# EAGLE design pwmsmu (EAGLE 5.11)
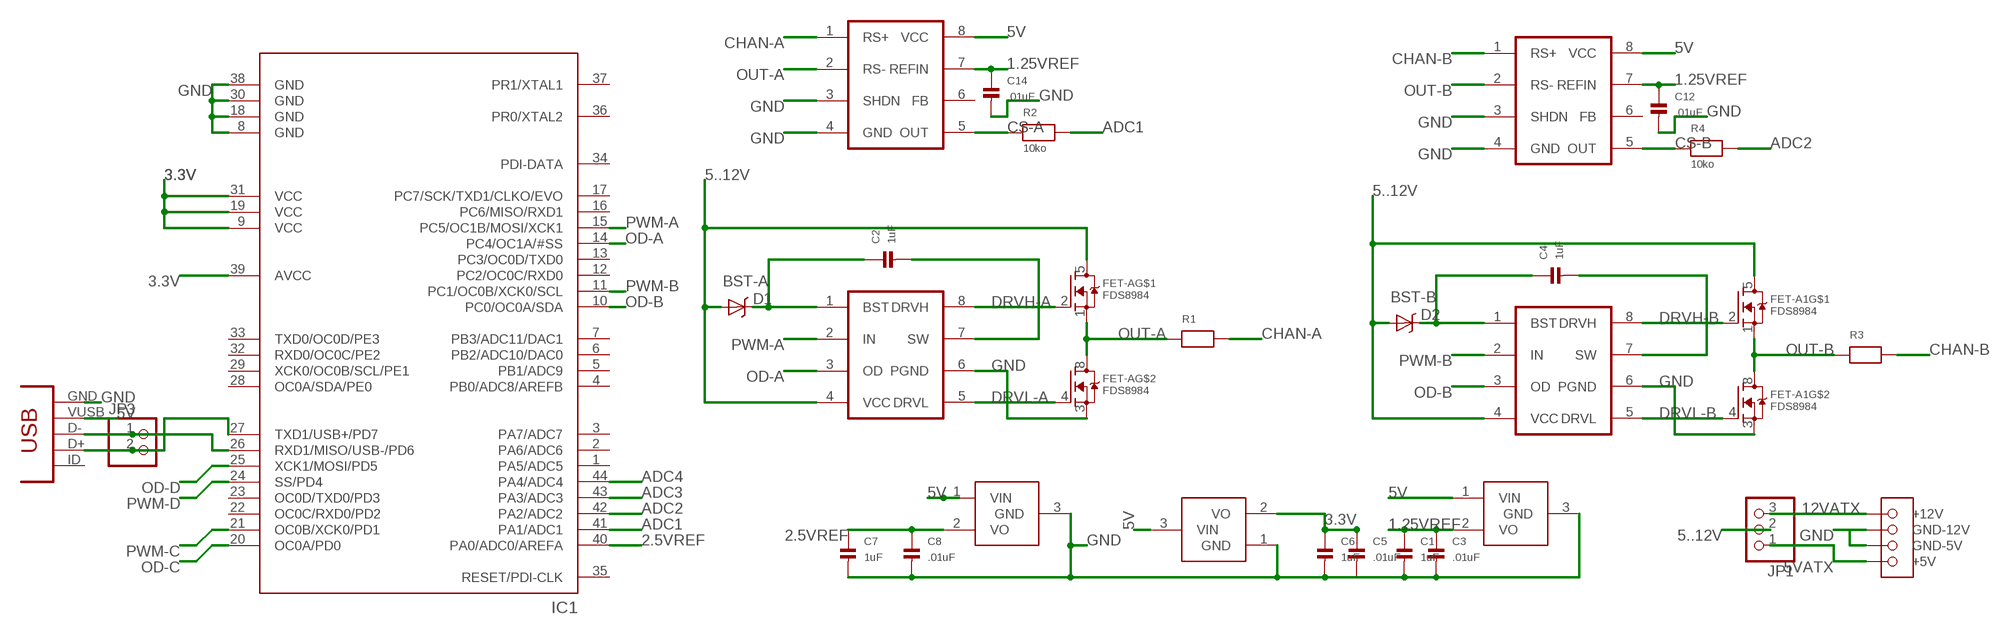
[diagram p0: schematic, sheet 1, part 1 of 2]
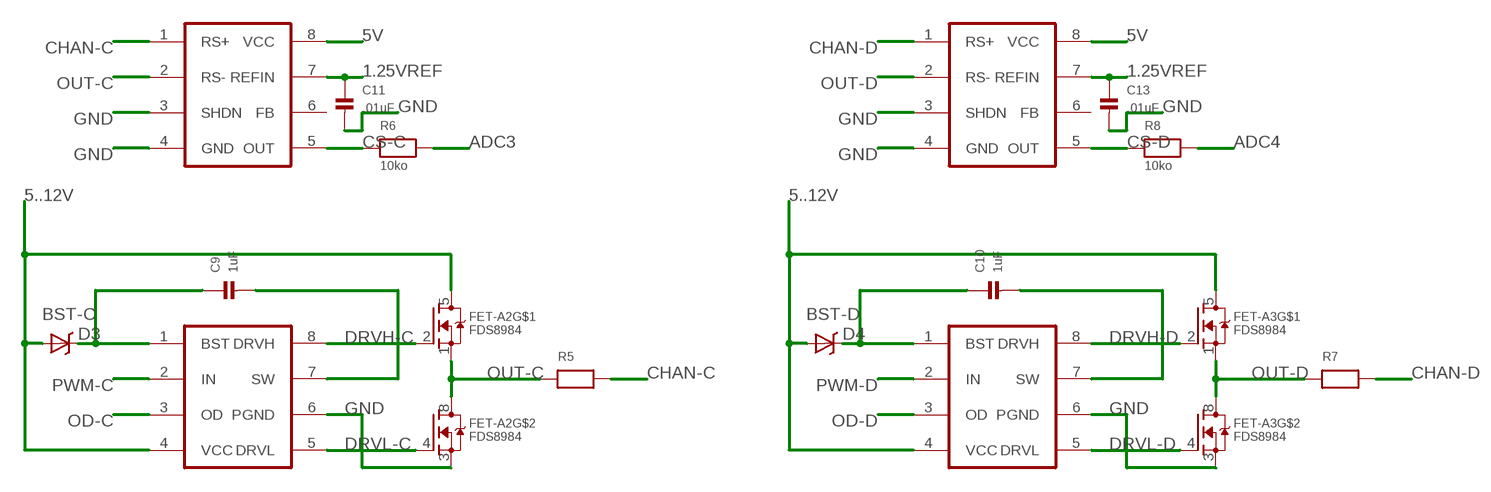
[diagram p1: schematic, sheet 1, part 2 of 2]

## Parts
1.25V  VREF  [SOT23-3]
2.5V  VREF  [SOT23-3]
3.3V  VREG  [SOT23-3]
ATXPSU  0015244742  [DISK_DRIVE_POWER]
C1  1uF  CAP_CERAMIC0603  [0603]
C2  1uF  CAP_CERAMIC0603  [0603]
C3  .01uF  CAP_CERAMIC0603  [0603]
C4  1uF  CAP_CERAMIC0603  [0603]
C5  .01uF  CAP_CERAMIC0603  [0603]
C6  1uF  CAP_CERAMIC0603  [0603]
C7  1uF  CAP_CERAMIC0603  [0603]
C8  .01uF  CAP_CERAMIC0603  [0603]
C9  1uF  CAP_CERAMIC0603  [0603]
C10  1uF  CAP_CERAMIC0603  [0603]
C11  .01uF  CAP_CERAMIC0603  [0603]
C12  .01uF  CAP_CERAMIC0603  [0603]
C13  .01uF  CAP_CERAMIC0603  [0603]
C14  .01uF  CAP_CERAMIC0603  [0603]
D1  SCHOTTKY  [SMA-DIODE]
D2  SCHOTTKY  [SMA-DIODE]
D3  SCHOTTKY  [SMA-DIODE]
D4  SCHOTTKY  [SMA-DIODE]
FET-A  FDS8984  FDS898SO-08  [SO-08@1]
FET-A1  FDS8984  FDS898SO-08  [SO-08@1]
FET-A2  FDS8984  FDS898SO-08  [SO-08@1]
FET-A3  FDS8984  FDS898SO-08  [SO-08@1]
IC1  ATXMEGAXXA4U  [TQFP-44]
JP1  HEADER-1X3ROUND  [1X03_ROUND]
JP3  HEADER-1X2ROUND  [1X02_ROUND]
R1  RESISTOR1206  [1206]
R2  10ko  RESISTOR0603  [0603]
R3  RESISTOR1206  [1206]
R4  10ko  RESISTOR0603  [0603]
R5  RESISTOR1206  [1206]
R6  10ko  RESISTOR0603  [0603]
R7  RESISTOR1206  [1206]
R8  10ko  RESISTOR0603  [0603]
U$2  ADP3120A  [SO-08]
U$3  MAX9919  [SO-08]
U$4  ADP3120A  [SO-08]
U$5  MAX9919  [SO-08]
U$6  ADP3120A  [SO-08]
U$7  MAX9919  [SO-08]
U$8  ADP3120A  [SO-08]
U$9  MAX9919  [SO-08]
USB1  USB-MINI-BUSB1  [CONN_USB_MINI-B]

## Nets
1.25VREF: 1.25V.2(VO) C1.1 C3.1 C11.1 C12.1 C13.1 C14.1 U$3.7(REFIN) U$5.7(REFIN) U$7.7(REFIN) U$9.7(REFIN)
2.5VREF: 2.5V.2(VO) C7.1 C8.1 IC1.40(PA0/ADC0/AREFA)
3.3V: 3.3V.2(VO) C5.1 C6.1 IC1.9(VCC) IC1.19(VCC) IC1.31(VCC) IC1.39(AVCC)
5..12V: D1.A D2.A D3.A D4.A FET-A1.5(D) FET-A2.5(D) FET-A3.5(D) FET-A.5(D) JP1.2 U$2.4(VCC) U$4.4(VCC) U$6.4(VCC) U$8.4(VCC)
5V: 1.25V.1(VIN) 2.5V.1(VIN) 3.3V.3(VIN) U$3.8(VCC) U$5.8(VCC) U$7.8(VCC) U$9.8(VCC) USB1.VUSB
5VATX: ATXPSU.P4(+5V) JP1.1
12VATX: ATXPSU.P1(+12V) JP1.3
ADC1: IC1.41(PA1/ADC1) R2.2
ADC2: IC1.42(PA2/ADC2) R4.2
ADC3: IC1.43(PA3/ADC3) R6.2
ADC4: IC1.44(PA4/ADC4) R8.2
BST-A: C2.1 D1.C U$2.1(BST)
BST-B: C4.1 D2.C U$4.1(BST)
BST-C: C9.1 D3.C U$6.1(BST)
BST-D: C10.1 D4.C U$8.1(BST)
CHAN-A: R1.2 U$3.1(RS+)
CHAN-B: R3.2 U$5.1(RS+)
CHAN-C: R5.2 U$7.1(RS+)
CHAN-D: R7.2 U$9.1(RS+)
CS-A: R2.1 U$3.5(OUT)
CS-B: R4.1 U$5.5(OUT)
CS-C: R6.1 U$7.5(OUT)
CS-D: R8.1 U$9.5(OUT)
D+: IC1.27(TXD1/USB+/PD7) JP3.2 USB1.D+
D-: IC1.26(RXD1/MISO/USB-/PD6) JP3.1 USB1.D-
DRVH-A: FET-A.2(G) U$2.8(DRVH)
DRVH-B: FET-A1.2(G) U$4.8(DRVH)
DRVH-C: FET-A2.2(G) U$6.8(DRVH)
DRVH-D: FET-A3.2(G) U$8.8(DRVH)
DRVL-A: FET-A.4(G) U$2.5(DRVL)
DRVL-B: FET-A1.4(G) U$4.5(DRVL)
DRVL-C: FET-A2.4(G) U$6.5(DRVL)
DRVL-D: FET-A3.4(G) U$8.5(DRVL)
GND: 1.25V.3(GND) 2.5V.3(GND) 3.3V.1(GND) ATXPSU.P2(GND-12V) ATXPSU.P3(GND-5V) C1.2 C3.2 C5.2 C6.2 C7.2 C8.2 C11.2 C12.2 C13.2 C14.2 FET-A1.3(S) FET-A2.3(S) FET-A3.3(S) FET-A.3(S) IC1.8(GND) IC1.18(GND) IC1.30(GND) IC1.38(GND) U$2.6(PGND) U$3.3(SHDN) U$3.4(GND) U$4.6(PGND) U$5.3(SHDN) U$5.4(GND) U$6.6(PGND) U$7.3(SHDN) U$7.4(GND) U$8.6(PGND) U$9.3(SHDN) U$9.4(GND) USB1.GND
OD-A: IC1.14(PC4/OC1A/#SS) U$2.3(OD)
OD-B: IC1.10(PC0/OC0A/SDA) U$4.3(OD)
OD-C: IC1.20(OC0A/PD0) U$6.3(OD)
OD-D: IC1.25(XCK1/MOSI/PD5) U$8.3(OD)
OUT-A: FET-A.1(S) FET-A.8(D) R1.1 U$3.2(RS-)
OUT-B: FET-A1.1(S) FET-A1.8(D) R3.1 U$5.2(RS-)
OUT-C: FET-A2.1(S) FET-A2.8(D) R5.1 U$7.2(RS-)
OUT-D: FET-A3.1(S) FET-A3.8(D) R7.1 U$9.2(RS-)
PWM-A: IC1.15(PC5/OC1B/MOSI/XCK1) U$2.2(IN)
PWM-B: IC1.11(PC1/OC0B/XCK0/SCL) U$4.2(IN)
PWM-C: IC1.21(OC0B/XCK0/PD1) U$6.2(IN)
PWM-D: IC1.24(SS/PD4) U$8.2(IN)
SW-A: C2.2 U$2.7(SW)
SW-B: C4.2 U$4.7(SW)
SW-C: C9.2 U$6.7(SW)
SW-D: C10.2 U$8.7(SW)
Unconnected: IC1.1(PA5/ADC5) IC1.2(PA6/ADC6) IC1.3(PA7/ADC7) IC1.4(PB0/ADC8/AREFB) IC1.5(PB1/ADC9) IC1.6(PB2/ADC10/DAC0) IC1.7(PB3/ADC11/DAC1) IC1.12(PC2/OC0C/RXD0) IC1.13(PC3/OC0D/TXD0) IC1.16(PC6/MISO/RXD1) IC1.17(PC7/SCK/TXD1/CLKO/EVO) IC1.22(OC0C/RXD0/PD2) IC1.23(OC0D/TXD0/PD3) IC1.28(OC0A/SDA/PE0) IC1.29(XCK0/OC0B/SCL/PE1) IC1.32(RXD0/OC0C/PE2) IC1.33(TXD0/OC0D/PE3) IC1.34(PDI-DATA) IC1.35(RESET/PDI-CLK) IC1.36(PR0/XTAL2) IC1.37(PR1/XTAL1) U$3.6(FB) U$5.6(FB) U$7.6(FB) U$9.6(FB) USB1.BODY@1(BODY) USB1.BODY@2(BODY) USB1.BODY@3(BODY) USB1.BODY@4(BODY) USB1.ID(USBID)

## Library data of the parts
1.25V 2.5V = nonolith:VREF
3.3V = nonolith:VREG
ATXPSU = SparkFun:0015244742: 5.08mm (.200") Pitch Disk Drive Power Connection System Header, Vertical, Through Hole, 4 Circuits, Lead-free, 2.12mm (.083") PC Tail Length, with PCB Locator Peg
C1-C14 = nonolith:CAP_CERAMIC: Ceramic Capacitors 0402 - 0402 Surface Mount Capacitors 0.1uF 10V 10% [Digikey: 490-1318-2-ND] 0603 - 0603 Surface Mount Capacitors 16 pF 50V 5% [Digikey: 445-5051-2-ND] 22 pF 50V [Digikey: PCC220ACVTR-ND] 33 pF 50V 5% [Digikey: 490-1415-1-ND] 56pF 50V 5% [Digikey: 490-1421-1-ND] 220pF 50V 5% [Digikey: 445-1285-1-ND] 680 pF 50V 2200 pF 50V 5% C0G [Digikey: 445-1297-1-ND] 5600 pF 100V 5% X7R [Digikey: 478-3711-1-ND] 0.1 µF 25V 10% [Digikey: PCC2277TR-ND] 0.22 µF 16V 10% X7R [Digikey: 445-1318-1-ND] 1.0 µF 25V 10% [Digikey: 445-5146-2-ND] 0603 - RF Specific 3pF 250V +/-0.1pF RF [Digikey: 712-1347-1-ND] 18 pF 250V 5% [Digikey: 478-3505-1-ND or 712-1322-1-ND] 56 pF 250V 5% C0G RF [Digikey: 490-4867-1-ND] 68 pF 250V RF [Digikey: 490-4868-1-ND] 0805 - 0805 Surface Mount Capacitors 220 pF 250V 2% RF Ceramic Capacitor [Digikey: 712-1398-1-ND] 1000 pF 50V 2% NP0 Ceramic Capacitor [Digikey: 478-3760-1-ND] 0.1 µF 25V 10% Ceramic Capacitor [Digikey: PCC1828TR-ND] 1.0 µF 16V 10% Ceramic Capacitor[Digikey: 490-1691-2-ND] 10.0 µF 10V 10% Ceramic Capacitor[Digikey: 709-1228-1-ND] 1206 - 1206 Surface Mount Capacitors
D1-D4 = nonolith:SCHOTTKY: Protection Diode: MBRA140
FET-A FET-A1-FET-A3 = nonolith:FDS898
IC1 = nonolith:ATXMEGAXXA4U: ATXMEGA A4U Series (XMEGA+USB)
JP1 = nonolith:HEADER-1X3: PIN HEADER
JP3 = nonolith:HEADER-1X2: PIN HEADER
R1-R8 = nonolith:RESISTOR: Resistors 0402 - 0402 Surface Mount Package 10.0K 1% 1/16W [Digikey: 311-10.0KLRTR-ND] 0603 - 0603 Surface Mount Package 0 Ohm 1/10 Watt 1% Resistor 15 Ohm 1/10 Watt 1% Resistor 33 Ohm 1/10 Watt 1% Resistor 49.9 Ohm 1/10 Watt 1% Resistor 100 Ohm 1/10 Watt 1% Resistor 150 Ohm 1/10 Watt 1% Resistor 240 Ohm 1/10 Watt 1% Resistor 390 Ohm 1/10 Watt 1% Resistor 560 Ohm 1/10 Watt 1% Resistor 750 Ohm 1/10 Watt 1% Resistor 1.0K Ohm 1/10 Watt 1% Resistor 1.5K Ohm 1/10 Watt 1% Resistor 2.0K Ohm 1/10 Watt 1% Resistor 4.7K Ohm 1/10 Watt 1% Resistor 10.0K Ohm 1/10 Watt 1% Resistor 20.0K Ohm 1/10 Watt 1% Resistor 33.0K Ohm 1/10 Watt 1% Resistor 100.0K Ohm 1/10 Watt 1% Resistor 0805 - 0805 Surface Mount Package 0 Ohm 1/8 Watt 1% Resistor 33 Ohm 1/8 Watt 1% Resistor 100 Ohm 1/8 Watt 1% Resistor 150 Ohm 1/8 Watt 1% Resistor 200 Ohm 1/8 Watt 1% Resistor 240 Ohm 1/8 Watt 1% Resistor 330 Ohm 1/8 Watt 1% Resistor 390 Ohm 1/8 Watt 1% Resistor 470 Ohm 1/8 Watt 1% Resistor 1.0K Ohm 1/8 Watt 1% Resistor 1.5K Ohm 1/8 Watt 1% Resistor 2.0K Ohm 1/8 Watt 1% Resistor 4.7K Ohm 1/8 Watt 1% Resistor 5.1K Ohm 1/8 Watt 1% Resistor 5.6K Ohm 1/8 Watt 1% Resistor 10.0K Ohm 1/8 Watt 1% Resistor 22.0K Ohm 1/8 Watt 1% Resistor 33.0K Ohm 1/8 Watt 1% Resistor 100K Ohm 1/8 Watt 1% Resistor 1206 - 1206 Surface Mount Package
U$2 U$4 U$6 U$8 = nonolith:ADP3120A: Dual Bootstrapped, 12 V MOSFET Driver with Output Disable
U$3 U$5 U$7 U$9 = nonolith:MAX9919: MAX9919 single-channel current sense amp with high common mode voltage range and high bandwidth
USB1 = nonolith:USB-MINI-B: USB connector

## Net classes
0 default: width 0.254 mm, clearance 0.127 mm

## Board
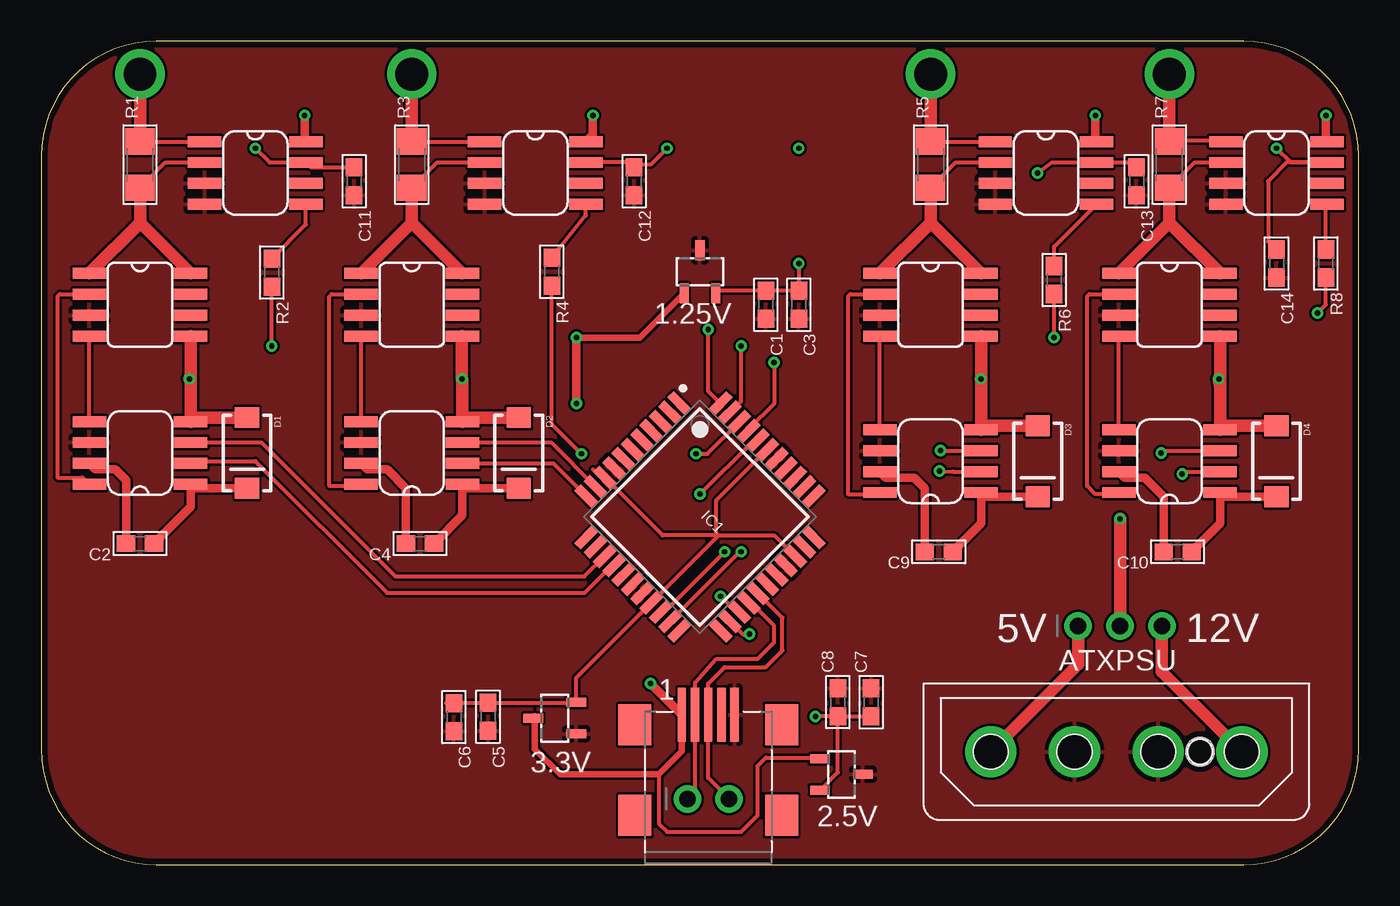
[diagram p2: board, top side]
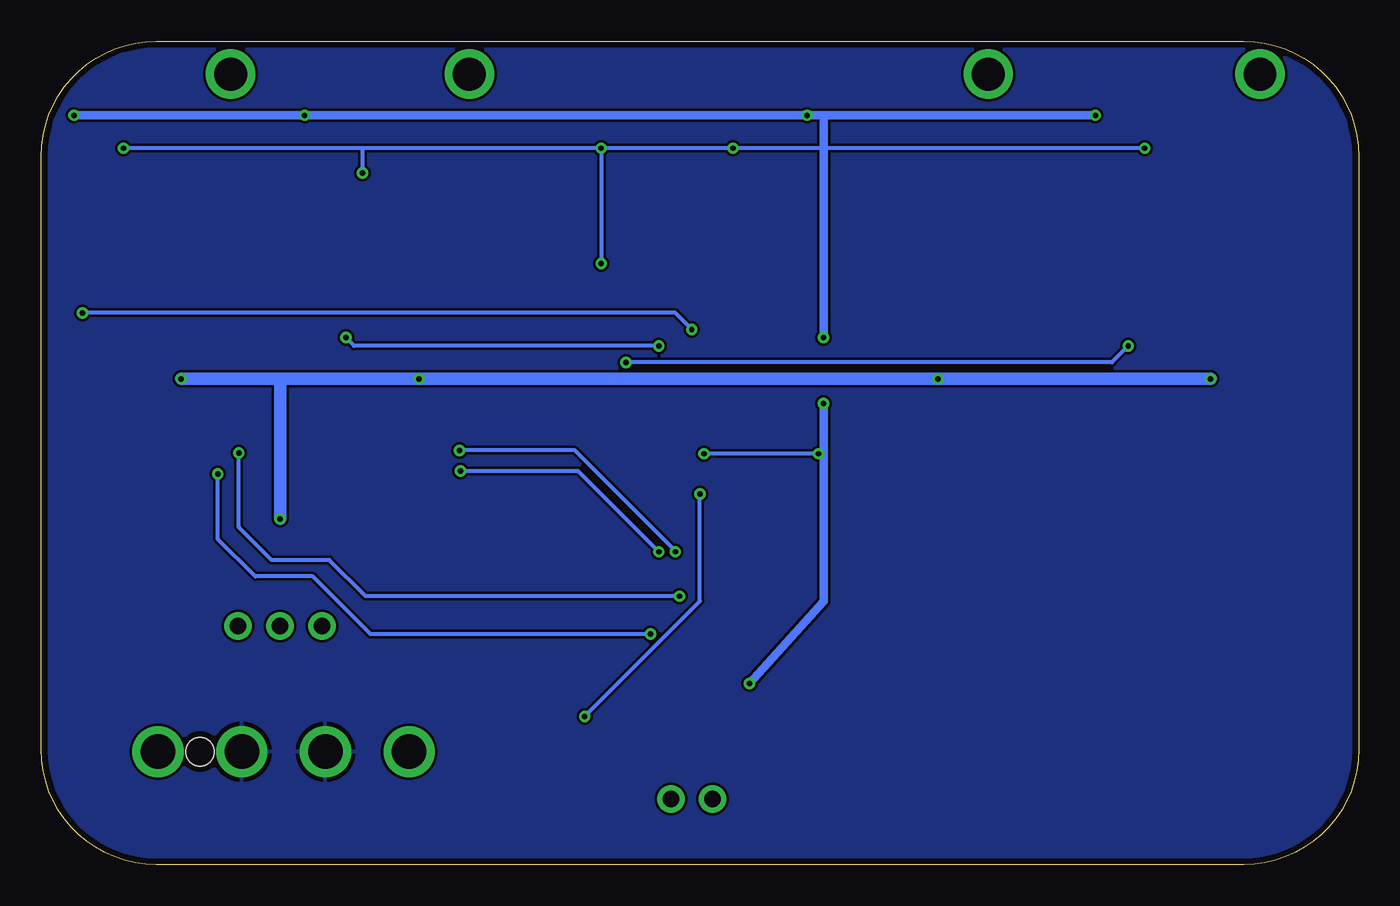
[diagram p3: board, bottom side, seen from below]

Size 80 x 50 mm. Coordinates in mm from the lower left corner, seen from the top.
Outline: 73,0 arc90 80,7 80,43 arc90 73,50 7,50 arc90 0,43 0,7 arc90 7,0 73,0
Copper layers (1*16): Top 0.0356mm / dielectric 1.5011mm / Bottom 0.0356mm
Design rules "LaenPCBOrder": minimum track width 6mil, minimum drill 13mil, track to track 6mil, track to pad 6mil, pad to pad 6mil, via to via 6mil, smd to smd 6mil, copper to edge 15mil, drill to drill 6mil, minimum pad ring 7mil, minimum via ring 7mil, stop-mask expansion 4mil, vias tented up to drill 0mil, thermal gap 10mil

### Footprints (pad centres in the part's own frame; a part is rotated, then mirrored left to right if it is on the bottom)
SOT23-3 = smd 0.55 x 1.2: 1 0.95,1.3; 2 -0.95,1.3; 3 0,-1.3
DISK_DRIVE_POWER = drill 2.096 round: P1 4.1,4.14; P2 9.18,4.14; P3 14.26,4.14; P4 19.34,4.14 | hole 1.7: 6.64,4.14
0603 = smd 1.1 x 1: 1 -0.85,0; 2 0.85,0
SMA-DIODE = smd 1.27 x 1.47: A -2.15,0; C 2.15,0
SO-08@1 = smd 0.66 x 2.032: 1 -1.905,-3.073; 2 -0.635,-3.073; 3 0.635,-3.073; 4 1.905,-3.073; 5 1.905,3.073; 6 0.635,3.073; 7 -0.635,3.073; 8 -1.905,3.073
TQFP-44 = smd 1.55 x 0.55: 1 -5.75,4; 2 -5.75,3.2; 3 -5.75,2.4; 4 -5.75,1.6; 5 -5.75,0.8; 6 -5.75,0; 7 -5.75,-0.8; 8 -5.75,-1.6; 9 -5.75,-2.4; 10 -5.75,-3.2; 11 -5.75,-4; 23 5.75,-4; 24 5.75,-3.2; 25 5.75,-2.4; 26 5.75,-1.6; 27 5.75,-0.8; 28 5.75,0; 29 5.75,0.8; 30 5.75,1.6; 31 5.75,2.4; 32 5.75,3.2; 33 5.75,4 | smd 0.55 x 1.55: 12 -4,-5.75; 13 -3.2,-5.75; 14 -2.4,-5.75; 15 -1.6,-5.75; 16 -0.8,-5.75; 17 0,-5.75; 18 0.8,-5.75; 19 1.6,-5.75; 20 2.4,-5.75; 21 3.2,-5.75; 22 4,-5.75; 34 4,5.75; 35 3.2,5.75; 36 2.4,5.75; 37 1.6,5.75; 38 0.8,5.75; 39 0,5.75; 40 -0.8,5.75; 41 -1.6,5.75; 42 -2.4,5.75; 43 -3.2,5.75; 44 -4,5.75
1X03_ROUND = drill 1 pad 1.676 round: 1 -2.54,0; 2 0,0; 3 2.54,0
1X02_ROUND = drill 1 pad 1.676 round: 1 -1.27,0; 2 1.27,0
1206 = smd 1.6 x 1.8: 1 -1.4,0; 2 1.4,0
SO-08 = smd 0.66 x 2.032: 1 -1.905,-3.073; 2 -0.635,-3.073; 3 0.635,-3.073; 4 1.905,-3.073; 5 1.905,3.073; 6 0.635,3.073; 7 -0.635,3.073; 8 -1.905,3.073
CONN_USB_MINI-B = smd 2 x 2.5: BODY@1 -4.45,2.5; BODY@2 4.45,2.5; BODY@3 4.45,-3; BODY@4 -4.45,-3 | smd 0.5 x 3.3: D+ 0,3.1; D- -0.8,3.1; GND 1.6,3.1; ID 0.8,3.1; VUSB -1.6,3.1

### Placement (x,y rotation side)
1.25V  40,36 180 top
2.5V  48.59,5.48 90 top
3.3V  31.18,8.9 270 top
ATXPSU  77,11 180 top
C1  44,34 270 top
C2  6,19.5 180 top
C3  46,34 270 top
C4  23,19.5 180 top
C5  27.13,8.98 270 top
C6  25.06,8.96 270 top
C7  50.39,9.86 90 top
C8  48.37,9.87 90 top
C9  54.5,19 180 top
C10  69,19 180 top
C11  19,41.5 270 top
C12  36,41.5 270 top
C13  66.5,41.5 270 top
C14  75,36.5 270 top
D1  12.5,25 270 top
D2  29,25 270 top
D3  60.5,24.5 270 top
D4  75,24.5 270 top
FET-A  6,34 270 top
FET-A1  22.5,34 270 top
FET-A2  54,34 270 top
FET-A3  68.5,34 270 top
IC1  40,21.12 315 top
JP1  65.5,14.5 0 top
JP3  40.5,4 0 top
R1  6,42.5 90 top
R2  14,35.95 270 top
R3  22.5,42.5 90 top
R4  31,36 270 top
R5  54,42.5 90 top
R6  61.5,35.5 270 top
R7  68.5,42.5 90 top
R8  78,36.5 270 top
U$2  6,25 90 top
U$3  13,42 270 top
U$4  22.5,25 90 top
U$5  30,42 270 top
U$6  54,24.5 90 top
U$7  61,42 270 top
U$8  68.5,24.5 90 top
U$9  75,42 270 top
USB1  40.5,6 0 top

### Tracks (layer width: path | path; a pad name or v marks a point on that pad's centre or on a via)
1.25VREF  (via drill 0.33)
  Top 0.254: 1.25V.2 41.1,34.85 C1.1 C3.1 v46,36.5 | v13,43.5 13.87,42.63 U$3.7 16.36,42.35 C11.1 | U$5.7 35.72,42.63 C12.1 36.15,42.5 37,42.5 v38,43.5 | v75,43.5 75.86,42.63 U$9.7 75.64,42.63 74.5,41.5 74.5,37.85 C14.1 | v60.5,42 61.37,42.63 U$7.7 66.22,42.63 C13.1
  Bottom 0.254: v46,43.5 v46,36.5 | v46,43.5 60.5,43.5 | 60.5,43.5 v75,43.5 | v13,43.5 37.5,43.5 v38,43.5 v46,43.5 | 60.5,43.5 v60.5,42
2.5VREF  (via drill 0.33)
  Top 0.254: C7.1 C8.1 48.37,8.5 | 43.75,25.75 IC1.40 43.25,25.75 v40,22.5 | 2.5V.2 48.37,5.61 48.37,8.5 | v47,9 47.87,9 48.37,8.5
  Bottom 0.254: v40,22.5 40,16 v47,9
3.3V
  Top 0.254: 41.14,20 IC1.19 32.48,11.34 3.3V.2 32.46,9.83 C5.1 24.58,9.83 C6.1 | 41.14,20 44.5,20 45.75,18.75 IC1.31 | 41.14,20 41,20 | 41,20 37.73,20 IC1.9 34.01,23.49 33.5,24 | IC1.39 41,22.12 41,20
5..12V  (via drill 0.33)
  Top 0.762: 57.07,29.5 U$6.4 57.32,26.65 D3.A | 57.07,29.5 FET-A2.5 | 71.57,29 U$8.4 71.82,26.65 D4.A | 71.57,29 FET-A3.5 | 9.07,29.5 U$2.4 9.32,27.15 D1.A | 9.07,29.5 FET-A.5 | D2.A 25.82,27.15 U$4.4 25.57,29.48 v25.55,29.5 25.55,32.07 FET-A1.5 | v65.5,21 JP1.2 | v71.5,29.5 71.57,29 | v57.05,29.5 57.07,29.5 | 9.07,29.5 v9,29.5
  Bottom 0.762: 65.5,29.5 v65.5,21 | 65.5,29.5 v57.05,29.5 v25.55,29.5 v9,29.5 | 65.5,29.5 v71.5,29.5
5V  (via drill 0.33)
  Top 0.254: 37.5,5.5 37.5,2.5 38,2 42.5,2 43.5,3 43.5,6 44,6.5 47.22,6.5 2.5V.1
  Top 0.381: 3.3V.3 29.98,9 29.98,7.02 31.5,5.5 37.5,5.5 38.9,6.9 USB1.VUSB | v32.5,32 36.35,32 1.25V.1
  Top 0.508: USB1.VUSB v37,11 | v32.5,28 v32.5,32 | U$3.8 16,43.98 v16,45.5 | U$5.8 33.5,44.33 v33.5,45.5 | U$7.8 64,43.98 v64,45.5 | U$9.8 78,43.98 v78,45.5
  Bottom 0.508: v37,11 32.5,16 v32.5,28 | v32.5,32 32.5,45.5 | 32.5,45.5 v33.5,45.5 v64,45.5 v78,45.5 | 32.5,45.5 v16,45.5
5VATX
  Top 0.762: ATXPSU.P4 62.96,12.16 JP1.1
12VATX
  Top 0.762: ATXPSU.P1 68.04,11.72 JP1.3
ADC1  (via drill 0.33)
  Top 0.254: v14,31.5 R2.2 | IC1.41 42.93,26.43 44.5,28 v44.5,30.5
  Bottom 0.254: v14,31.5 15,30.5 v44.5,30.5
ADC2  (via drill 0.33)
  Top 0.254: IC1.42 40.45,24.95 v39.75,24.95 | v32.8,24.95 31,26.75 R4.2
  Bottom 0.254: v32.8,24.95 v39.75,24.95
ADC3  (via drill 0.33)
  Top 0.254: v61.5,32 R6.2 | IC1.43 42.5,28.15 v42.5,31.5
  Bottom 0.254: v61.5,32 61,31.5 v42.5,31.5
ADC4  (via drill 0.33)
  Top 0.254: R8.2 78,34 v77.5,33.5 | v40.5,32.5 40.5,28.75 IC1.44
  Bottom 0.254: v77.5,33.5 41.5,33.5 v40.5,32.5
BST-A
  Top 0.508: D1.C 9.32,22.85 U$2.1 9.07,21.72 C2.1
BST-B
  Top 0.508: D2.C 25.82,22.85 U$4.1 25.57,21.22 C4.1
BST-C
  Top 0.508: D3.C 57.32,22.35 U$6.1 57.07,20.72 C9.1
BST-D
  Top 0.508: D4.C 71.82,22.35 U$8.1 71.57,20.72 C10.1
CHAN-A  (via drill 2)
  Top 0.254: R1.2 U$3.1
  Top 0.762: R1.2 v6,48
CHAN-B  (via drill 2)
  Top 0.254: R3.2 23,43.91 U$5.1
  Top 0.762: R3.2 v22.5,48
CHAN-C  (via drill 2)
  Top 0.254: R5.2 U$7.1
  Top 0.762: R5.2 v54,48
CHAN-D  (via drill 2)
  Top 0.254: R7.2 68.6,44 71.5,44 71.59,43.91 U$9.1
  Top 0.762: R7.2 v68.5,48
CS-A
  Top 0.254: R2.1 16.07,38.87 U$3.5
CS-B
  Top 0.254: R4.1 33.07,39.42 U$5.5
CS-C
  Top 0.254: U$7.5 61.5,37.52 R6.1
CS-D
  Top 0.254: U$9.5 78,40.02 R8.1
D+
  Top 0.254: JP3.2 40.5,5.27 USB1.D+ 40.5,11 41.5,12 44,12 45,13 45,15 44,16 IC1.27
D-
  Top 0.254: JP3.1 39.7,4.47 USB1.D- 39.7,11.05 41,12.5 43.5,12.5 44.5,13.5 44.5,14.5 43.08,15.92 IC1.26
DRVH-A
  Top 0.254: U$2.8 2.52,23.5 1,23.5 1,34.5 1.14,34.63 FET-A.2
DRVH-B
  Top 0.254: U$4.8 19.33,23 17.5,23 17.5,34.5 17.64,34.63 FET-A1.2
DRVH-C
  Top 0.254: U$6.8 50.83,22.5 49,22.5 49,34.5 49.13,34.63 FET-A2.2
DRVH-D
  Top 0.254: U$8.8 65.33,22.5 64,22.5 63.5,23 63.5,34.5 63.63,34.63 FET-A3.2
DRVL-A
  Top 0.254: U$2.5 FET-A.4
DRVL-B
  Top 0.254: U$4.5 FET-A1.4
DRVL-C
  Top 0.254: U$6.5 FET-A2.4
DRVL-D
  Top 0.254: U$8.5 FET-A3.4
GND
  pour Top: 80,3 arc-90 46.5,0 5,0 arc-90 0,5 0,43 arc-90 7,50 75,50 arc-90 80,45
  pour Bottom: 7.07,50 arc91 0,42.93 0,3 arc90 3,0 74.5,0 arc90 80,5 80,47 arc90 77,50
OD-A
  Top 0.254: U$2.3 13.37,25.64 21.5,17.5 32.98,17.5 IC1.14
OD-B
  Top 0.254: U$4.3 30.96,25.64 IC1.10
OD-C  (via drill 0.33)
  Top 0.254: IC1.20 37.86,15.36 v41.5,19 | v54.6,25.15 54.63,25.14 U$6.3
  Bottom 0.254: v54.6,25.15 47.6,25.15 41.5,19.05 v41.5,19
OD-D  (via drill 0.33)
  Top 0.254: IC1.25 42.19,15.36 v41.25,16.3 | v68,25 68.14,25.14 U$8.3
  Bottom 0.254: v68,25 68,20.5 66,18.5 62.5,18.5 60.3,16.3 v41.25,16.3
OUT-A
  Top 0.254: R1.1 7.54,42.63 U$3.2
  Top 0.762: FET-A.1 6,38.98 | 6,38.98 FET-A.8 | 6,38.98 R1.1
OUT-B
  Top 0.254: R3.1 24.04,42.63 U$5.2
  Top 0.762: FET-A1.1 22.5,38.98 | 22.5,38.98 FET-A1.8 | 22.5,38.98 R3.1
OUT-C
  Top 0.254: R5.1 55.53,42.63 U$7.2
  Top 0.762: FET-A2.1 54,38.98 | 54,38.98 FET-A2.8 | 54,38.98 R5.1
OUT-D
  Top 0.254: R7.1 70.03,42.63 U$9.2
  Top 0.762: FET-A3.1 68.5,38.98 | 68.5,38.98 FET-A3.8 | 68.5,38.98 R7.1
PWM-A
  Top 0.254: IC1.15 34.69,18.19 33,16.5 21,16.5 13,24.5 9.21,24.5 U$2.2
PWM-B
  Top 0.254: IC1.11 31.1,24.36 U$4.2
PWM-C  (via drill 0.33)
  Top 0.254: IC1.21 42.4,19 v42.5,19 | v54.55,23.9 55.37,23.86 U$6.2
  Bottom 0.254: v42.5,19 47.4,23.9 v54.55,23.9
PWM-D  (via drill 0.33)
  Top 0.254: IC1.24 42.6,14 v43,14 | U$8.2 69.42,23.86 v69.28,23.73
  Bottom 0.254: 69.45,23.9 v69.28,23.73 69.28,19.77 67,17.5 63.5,17.5 60,14 v43,14
SW-A
  Top 0.508: U$2.7 3.29,24 4.5,24 5.15,23.35 C2.2
SW-B
  Top 0.508: U$4.7 19.79,24 21,24 22.15,22.85 C4.2
SW-C
  Top 0.508: U$6.7 51.29,23.5 53,23.5 53.65,22.85 C9.2
SW-D
  Top 0.508: U$8.7 65.79,23.5 67,23.5 68.15,22.35 C10.2

### Text on the board
tNames: 5V | 12V